# Altium schematic sheet EVK-NORA-W1_SCHEM_0003_Shield_Conn.SchDoc
size B; Date: 7/24/2020; CompanyName: U-blox; DrawnBy: EMOO; Engineer: EMOO; Organization: U-blox; Address1: 3950 Fairview Industrial Dr SE #100; Address2: Salem, OR 97302; SheetNumber: 5; SheetTotal: 6; SheetSize: B; SheetTitle: Connectors
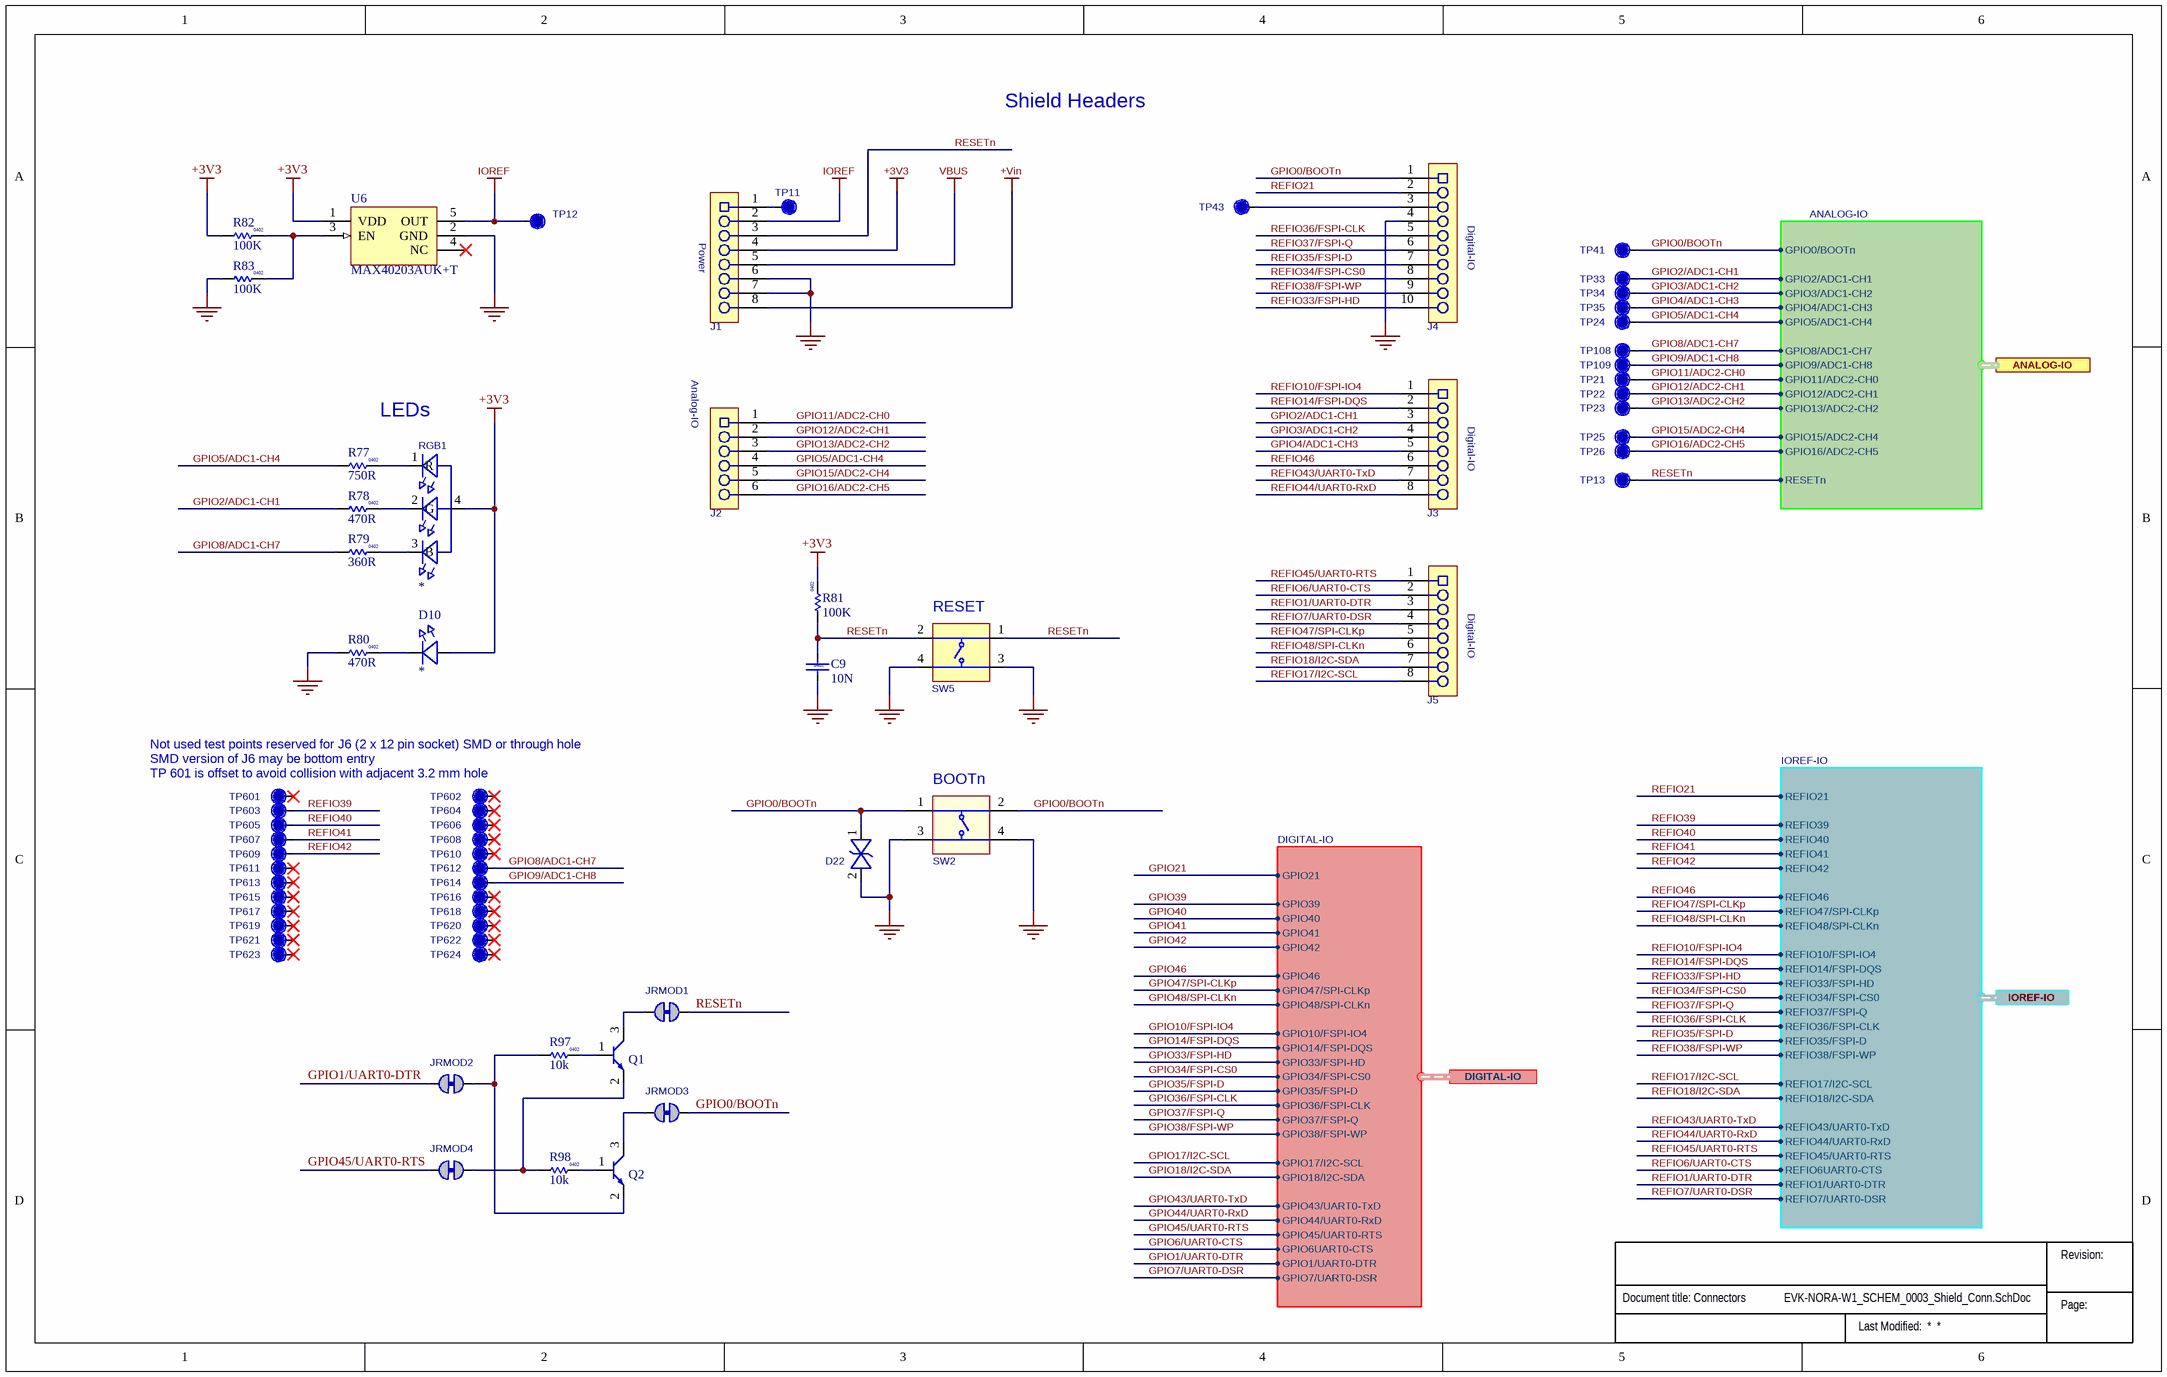
[diagram p0: EVK-NORA-W1_SCHEM_0003_Shield_Conn.SchDoc]

## Parts
?  (no value)  (graphical)
C9  value 10N  Size: 0402  [Cap 0402]
D10  (no value)  [LED-0603]
D22  110-00019  [SOD-923]  (value not drawn)
J1  (no value)  [SKT-0.1P-SSM-108-L-SV]
J2  (no value)  [SKT-0.1P-SSM-106-L-SV]
J3  (no value)  [SKT-0.1P-SSM-108-L-SV]
J4  (no value)  [SKT-0.1P-SSM-110-L-SV]
J5  (no value)  [SKT-0.1P-SSM-108-L-SV]
JRMOD1  Solderbridge-ShortDNP  [Solderbridge-Short]  (value not drawn)  (net tie, no BOM)
JRMOD2  Solderbridge-ShortDNP  [Solderbridge-Short]  (value not drawn)  (net tie, no BOM)
JRMOD3  Solderbridge-ShortDNP  [Solderbridge-Short]  (value not drawn)  (net tie, no BOM)
JRMOD4  Solderbridge-ShortDNP  [Solderbridge-Short]  (value not drawn)  (net tie, no BOM)
Q1  (no value)  [SOT-23]
Q2  (no value)  [SOT-23]
R77  value 750R  Size: 0402  [RES 0402 HD]
R78  value 470R  Size: 0402  [RES 0402 HD]
R79  value 360R  Size: 0402  [RES 0402 HD]
R80  value 470R  Size: 0402  [RES 0402 HD]
R81  value 100K  Size: 0402  [RES 0402 HD]
R82  value 100K  Size: 0402  [RES 0402 HD]
R83  value 100K  Size: 0402  [RES 0402 HD]
R97  value 10k  Size: 0402  [RES 0402 HD]
R98  value 10k  Size: 0402  [RES 0402 HD]
RGB1  (no value)  [LED_1616]
SW2  (no value)  [SW_TACT_SMT_6mm]
SW5  135-00002  [SW_TACT_SMT_6mm]  (value not drawn)
TP11  TP  [TP10R]  (value not drawn)  (no BOM)
TP12  TP  [TP10R]  (value not drawn)  (no BOM)
TP13  TP  [TP10R]  (value not drawn)  (no BOM)
TP21  TP  [TP10R]  (value not drawn)  (no BOM)
TP22  TP  [TP10R]  (value not drawn)  (no BOM)
TP23  TP  [TP10R]  (value not drawn)  (no BOM)
TP24  TP  [TP10R]  (value not drawn)  (no BOM)
TP25  TP  [TP10R]  (value not drawn)  (no BOM)
TP26  TP  [TP10R]  (value not drawn)  (no BOM)
TP33  TP  [TP10R]  (value not drawn)  (no BOM)
TP34  TP  [TP10R]  (value not drawn)  (no BOM)
TP35  TP  [TP10R]  (value not drawn)  (no BOM)
TP41  TP  [TP10R]  (value not drawn)  (no BOM)
TP43  TP  [TP10R]  (value not drawn)  (no BOM)
TP108  TP  [TP10R]  (value not drawn)  (no BOM)
TP109  TP  [TP10R]  (value not drawn)  (no BOM)
TP601  TP  [TP10R]  (value not drawn)  (no BOM)
TP602  TP  [TP10R]  (value not drawn)  (no BOM)
TP603  TP  [TP10R]  (value not drawn)  (no BOM)
TP604  TP  [TP10R]  (value not drawn)  (no BOM)
TP605  TP  [TP10R]  (value not drawn)  (no BOM)
TP606  TP  [TP10R]  (value not drawn)  (no BOM)
TP607  TP  [TP10R]  (value not drawn)  (no BOM)
TP608  TP  [TP10R]  (value not drawn)  (no BOM)
TP609  TP  [TP10R]  (value not drawn)  (no BOM)
TP610  TP  [TP10R]  (value not drawn)  (no BOM)
TP611  TP  [TP10R]  (value not drawn)  (no BOM)
TP612  TP  [TP10R]  (value not drawn)  (no BOM)
TP613  TP  [TP10R]  (value not drawn)  (no BOM)
TP614  TP  [TP10R]  (value not drawn)  (no BOM)
TP615  TP  [TP10R]  (value not drawn)  (no BOM)
TP616  TP  [TP10R]  (value not drawn)  (no BOM)
TP617  TP  [TP10R]  (value not drawn)  (no BOM)
TP618  TP  [TP10R]  (value not drawn)  (no BOM)
TP619  TP  [TP10R]  (value not drawn)  (no BOM)
TP620  TP  [TP10R]  (value not drawn)  (no BOM)
TP621  TP  [TP10R]  (value not drawn)  (no BOM)
TP622  TP  [TP10R]  (value not drawn)  (no BOM)
TP623  TP  [TP10R]  (value not drawn)  (no BOM)
TP624  TP  [TP10R]  (value not drawn)  (no BOM)
U6  Manufacturer Part Number 1: MAX40203AUK+T  [SOT-23-5]

## Ports
ANALOG-IO (harness ANALOG-IO), DIGITAL-IO (harness DIGITAL-IO), IOREF-IO (harness IOREF-IO)

## Harnesses
ANALOG-IO: GPIO0/BOOTn, GPIO11/ADC2-CH0, GPIO12/ADC2-CH1, GPIO13/ADC2-CH2, GPIO15/ADC2-CH4, GPIO16/ADC2-CH5, GPIO2/ADC1-CH1, GPIO3/ADC1-CH2, GPIO4/ADC1-CH3, GPIO5/ADC1-CH4, GPIO8/ADC1-CH7, GPIO9/ADC1-CH8, RESETn
IOREF-IO: REFIO1/UART0-DTR, REFIO10/FSPI-IO4, REFIO14/FSPI-DQS, REFIO17/I2C-SCL, REFIO18/I2C-SDA, REFIO21, REFIO33/FSPI-HD, REFIO34/FSPI-CS0, REFIO37/FSPI-Q, REFIO36/FSPI-CLK, REFIO35/FSPI-D, REFIO38/FSPI-WP, REFIO39, REFIO40, REFIO41, REFIO42, REFIO43/UART0-TxD, REFIO44/UART0-RxD, REFIO45/UART0-RTS, REFIO46, REFIO47/SPI-CLKp, REFIO48/SPI-CLKn, REFIO6UART0-CTS, REFIO7/UART0-DSR
DIGITAL-IO: GPIO1/UART0-DTR, GPIO6UART0-CTS, GPIO7/UART0-DSR, GPIO10/FSPI-IO4, GPIO14/FSPI-DQS, GPIO17/I2C-SCL, GPIO18/I2C-SDA, GPIO21, GPIO33/FSPI-HD, GPIO34/FSPI-CS0, GPIO35/FSPI-D, GPIO36/FSPI-CLK, GPIO37/FSPI-Q, GPIO38/FSPI-WP, GPIO39, GPIO40, GPIO41, GPIO42, GPIO43/UART0-TxD, GPIO44/UART0-RxD, GPIO45/UART0-RTS, GPIO46, GPIO47/SPI-CLKp, GPIO48/SPI-CLKn

## Nets
+3V3: D10.2(A) J1.4 R81.2 R82.1 RGB1.4(A) U6.1(VDD)
+Vin: J1.8
GND: C9.2 D22.2 J1.6 J1.7 J4.4 R80.1 R83.1 SW2.3 SW2.4 SW5.3(T3) SW5.4(T3) U6.2(GND)
IOREF: J1.2 TP12.1 U6.5(OUT)
VBUS: J1.5
GPIO0/BOOTn: D22.1 J4.1 JRMOD3.1 SW2.1 SW2.2 TP41.1 ; port ANALOG-IO.GPIO0/BOOTn
GPIO1/UART0-DTR: JRMOD2.2 ; port DIGITAL-IO.GPIO1/UART0-DTR
GPIO2/ADC1-CH1: J3.3 R78.1 TP33.1 ; port ANALOG-IO.GPIO2/ADC1-CH1
GPIO3/ADC1-CH2: J3.4 TP34.1 ; port ANALOG-IO.GPIO3/ADC1-CH2
GPIO4/ADC1-CH3: J3.5 TP35.1 ; port ANALOG-IO.GPIO4/ADC1-CH3
GPIO5/ADC1-CH4: J2.4 R77.1 TP24.1 ; port ANALOG-IO.GPIO5/ADC1-CH4
GPIO6/UART0-CTS: port DIGITAL-IO.GPIO6UART0-CTS
GPIO7/UART0-DSR: port DIGITAL-IO.GPIO7/UART0-DSR
GPIO8/ADC1-CH7: R79.1 TP108.1 TP612.1 ; port ANALOG-IO.GPIO8/ADC1-CH7
GPIO9/ADC1-CH8: TP109.1 TP614.1 ; port ANALOG-IO.GPIO9/ADC1-CH8
GPIO10/FSPI-IO4: port DIGITAL-IO.GPIO10/FSPI-IO4
GPIO11/ADC2-CH0: J2.1 TP21.1 ; port ANALOG-IO.GPIO11/ADC2-CH0
GPIO12/ADC2-CH1: J2.2 TP22.1 ; port ANALOG-IO.GPIO12/ADC2-CH1
GPIO13/ADC2-CH2: J2.3 TP23.1 ; port ANALOG-IO.GPIO13/ADC2-CH2
GPIO14/FSPI-DQS: port DIGITAL-IO.GPIO14/FSPI-DQS
GPIO15/ADC2-CH4: J2.5 TP25.1 ; port ANALOG-IO.GPIO15/ADC2-CH4
GPIO16/ADC2-CH5: J2.6 TP26.1 ; port ANALOG-IO.GPIO16/ADC2-CH5
GPIO17/I2C-SCL: port DIGITAL-IO.GPIO17/I2C-SCL
GPIO18/I2C-SDA: port DIGITAL-IO.GPIO18/I2C-SDA
GPIO21: port DIGITAL-IO.GPIO21
GPIO33/FSPI-HD: port DIGITAL-IO.GPIO33/FSPI-HD
GPIO34/FSPI-CS0: port DIGITAL-IO.GPIO34/FSPI-CS0
GPIO35/FSPI-D: port DIGITAL-IO.GPIO35/FSPI-D
GPIO36/FSPI-CLK: port DIGITAL-IO.GPIO36/FSPI-CLK
GPIO37/FSPI-Q: port DIGITAL-IO.GPIO37/FSPI-Q
GPIO38/FSPI-WP: port DIGITAL-IO.GPIO38/FSPI-WP
GPIO39: port DIGITAL-IO.GPIO39
GPIO40: port DIGITAL-IO.GPIO40
GPIO41: port DIGITAL-IO.GPIO41
GPIO42: port DIGITAL-IO.GPIO42
GPIO43/UART0-TxD: port DIGITAL-IO.GPIO43/UART0-TxD
GPIO44/UART0-RxD: port DIGITAL-IO.GPIO44/UART0-RxD
GPIO45/UART0-RTS: JRMOD4.2 ; port DIGITAL-IO.GPIO45/UART0-RTS
GPIO46: port DIGITAL-IO.GPIO46
GPIO47/SPI-CLKp: port DIGITAL-IO.GPIO47/SPI-CLKp
GPIO48/SPI-CLKn: port DIGITAL-IO.GPIO48/SPI-CLKn
REFIO1/UART0-DTR: J5.3 ; port IOREF-IO.REFIO1/UART0-DTR
REFIO6/UART0-CTS: J5.2 ; port IOREF-IO.REFIO6UART0-CTS
REFIO7/UART0-DSR: J5.4 ; port IOREF-IO.REFIO7/UART0-DSR
REFIO10/FSPI-IO4: J3.1 ; port IOREF-IO.REFIO10/FSPI-IO4
REFIO14/FSPI-DQS: J3.2 ; port IOREF-IO.REFIO14/FSPI-DQS
REFIO17/I2C-SCL: J5.8 ; port IOREF-IO.REFIO17/I2C-SCL
REFIO18/I2C-SDA: J5.7 ; port IOREF-IO.REFIO18/I2C-SDA
REFIO21: J4.2 ; port IOREF-IO.REFIO21
REFIO33/FSPI-HD: J4.10 ; port IOREF-IO.REFIO33/FSPI-HD
REFIO34/FSPI-CS0: J4.8 ; port IOREF-IO.REFIO34/FSPI-CS0
REFIO35/FSPI-D: J4.7 ; port IOREF-IO.REFIO35/FSPI-D
REFIO36/FSPI-CLK: J4.5 ; port IOREF-IO.REFIO36/FSPI-CLK
REFIO37/FSPI-Q: J4.6 ; port IOREF-IO.REFIO37/FSPI-Q
REFIO38/FSPI-WP: J4.9 ; port IOREF-IO.REFIO38/FSPI-WP
REFIO39: TP603.1 ; port IOREF-IO.REFIO39
REFIO40: TP605.1 ; port IOREF-IO.REFIO40
REFIO41: TP607.1 ; port IOREF-IO.REFIO41
REFIO42: TP609.1 ; port IOREF-IO.REFIO42
REFIO43/UART0-TxD: J3.7 ; port IOREF-IO.REFIO43/UART0-TxD
REFIO44/UART0-RxD: J3.8 ; port IOREF-IO.REFIO44/UART0-RxD
REFIO45/UART0-RTS: J5.1 ; port IOREF-IO.REFIO45/UART0-RTS
REFIO46: J3.6 ; port IOREF-IO.REFIO46
REFIO47/SPI-CLKp: J5.5 ; port IOREF-IO.REFIO47/SPI-CLKp
REFIO48/SPI-CLKn: J5.6 ; port IOREF-IO.REFIO48/SPI-CLKn
RESETn: C9.1 J1.3 JRMOD1.1 R81.1 SW5.1(T1) SW5.2(T2) TP13.1 ; port ANALOG-IO.RESETn
NetD10_1: D10.1(C) R80.2
NetJ1_1: J1.1 TP11.1
NetJ4_3: J4.3 TP43.1
NetJRMOD1_2: JRMOD1.2 Q1.3(C)
NetJRMOD2_1: JRMOD2.1 Q2.2(E) R97.1
NetJRMOD3_2: JRMOD3.2 Q2.3(C)
NetJRMOD4_1: JRMOD4.1 Q1.2(E) R98.1
NetQ1_1: Q1.1(B) R97.2
NetQ2_1: Q2.1(B) R98.2
NetR77_2: R77.2 RGB1.1(R)
NetR78_2: R78.2 RGB1.2(G)
NetR79_2: R79.2 RGB1.3(B)
NetR82_2: R82.2 R83.2 U6.3(EN)

Not connected (* = marked no-connect by the designer): TP601 1*; TP602 1*; TP604 1*; TP606 1*; TP608 1*; TP610 1*; TP611 1*; TP613 1*; TP615 1*; TP616 1*; TP617 1*; TP618 1*; TP619 1*; TP620 1*; TP621 1*; TP622 1*; TP623 1*; TP624 1*; U6 4(NC)*

## Notes on the sheet
- Shield Headers
- (near J1) Power
- (near J4) Digital-IO
- LEDs
- (near J2) Analog-IO
- (near J3) Digital-IO
- (near SW5) RESET
- (near J5) Digital-IO
- Not used test points reserved for J6 (2 x 12 pin socket) SMD or through hole
- SMD version of J6 may be bottom entry
- TP 601 is offset to avoid collision with adjacent 3.2 mm hole
- (near SW2) BOOTn
- Revision:
- Page:

## Library data of the parts
? = Sub_Title_Block: Minimized schematic title block for all subset sheets
C9 = UBXH01-0023025: CAP CER X7R 0402 10N 10% 16V; Manufacturer: Murata Manufacturing Company, Ltd.; Manufacturer P/N: GRM155R71C103KA01; Editor: roland.rust; Released by: anthony.gergis; Env: ROHS; Permitted Use: Volume Products; Perferred: PREF; Mfg P/N Status: NRND; Mfg P/N Split: 100; Mfg P/N Released: Yes; Part Number: UBXH01-0023025; Tolerance: 10%; Max Voltage: 16V; Min Operating Temp: -55°C; Max Operating Temp: 125°C; Part Type: Capacitor; Release Data: 2021-02-16 13:14:11.218378; UBX Wiki: https://wiki.u-blox.com/bin/view/Operations/PartDetails?index=5491; RefDes: C; Manufacturer 2: Samsung Electro-Mechanics; Manufacturer P/N 2: CL05B103KO5NNNC; Mfg P/N Status 2: Active; Mfg P/N Split 2: 0; Mfg P/N Released 2: Yes; Mfg P/N Datasheet 2: https://wiki.u-blox.com/bin/view/Generic/Docs/DocumentSummary?index=28567
D10 = UBXH11-0000018: LED CHIP 0603 LOW CURRENT OSRAM 0.002A GREEN 2.2V 2mA; Manufacturer P/N: LG L29K-G2J1-24; Editor: johann.furrer; Released by: martin.grasse; Env: ROHS; Permitted Use: Volume Products; Perferred: PREF; Mfg P/N Status: Active; Mfg P/N Split: 100; Mfg P/N Released: Yes; Color: *; Part Number: UBXH11-0000018; Value: GREEN; Max Voltage: 2.2V; Max Current: 2mA; Size: 0603; Min Operating Temp: -40°C; Max Operating Temp: 85°C; Part Type: LED; Release Data: 2018-01-09 15:31:38.754561; UBX Wiki: https://wiki.u-blox.com/bin/view/Operations/PartDetails?index=20619; RefDes: DS; Manufacturer: Osram; Mfg P/N Datasheet: https://wiki.u-blox.com/bin/view/Generic/Docs/DocumentSummary?index=20620
D22 = 110-00019: ESD9B3.3ST5G; Part Name: Diode TVS 3.3V SOD-923; Part_Type: Diode; Manufacturer: ON Semiconductor; Item_Phase: Preliminary; Body Size: 0.8mm x 0.6mm; Component Mounting Type: SMT; Diode Type: TVS; Use in new designs: Yes; Voltage: 3.3V; Part Number: 110-00019; Manufacturer P/N: ESD9B3.3ST5G; Supplier 1: Digi-Key; Supplier Part Number 1: ESD9B3.3ST5GOSCT-ND; Arena Link: https://app.bom.com/a/4M5DJQ9Q9SR7DV4H?v=spec.summary; Height: 0.4mm; MFG Package: SOD-923; Package Type: SOD; Pins: 2
J1 J3 J5 = 130-00102: Socket Strip 0.1" 8 Pin 1Row SMD Black; Manufacturer 1: Seeed Technology; Manufacturer Part Number 1: Rigado 130-00102; Part Name: CON SKT Strip 0.1" 8Pin 1Row SMD Black; Item Phase: In Production; Use in new designs: Yes; Voltage: 572VDC; UBX Code: None; Part Number: 130-00102; Supplier 1: Seeed Technology; Supplier Part Number 1: Rigado 130-00102; Diameter: None; Height: 7.37mm; Max Operating Temp: 105; Min Operating Temp: -55; Pins: 8; Revision: 0C; Manufacturer 2: Samtec; Manufacturer Part Number 2: SSM-108-F-SV-P-TR; Supplier 2: Avnet; Supplier Part Number 2: SSM-108-F-SV-P-TR
J2 = 130-00103: Socket Strip 0.1" 6Pin 1Row SMD Black; Manufacturer 1: Seeed Technology; Manufacturer Part Number 1: Rigado 130-00103; Part Name: CON SKT Strip 0.1" 6Pin 1Row SMD Black; Item Phase: In Production; Use in new designs: Yes; Voltage: 572VDC; UBX Code: None; Manufacturer P/N: *; Part Number: 130-00103; Supplier 1: Seeed Technology; Supplier Part Number 1: Rigado 130-00103; Diameter: None; Height: 7.37mm; Max Operating Temp: 105; Min Operating Temp: -55; Pins: 6; Revision: 0C; Manufacturer 2: Samtec; Manufacturer Part Number 2: SSM-106-F-SV-P-TR; Supplier 2: Avnet; Supplier Part Number 2: SSM-106-F-SV-P-TR
J4 = 130-00101: Socket Strip 0.1" 10Pin 1Row SMD Black; Manufacturer 1: Seeed Technology; Manufacturer Part Number 1: Rigado 130-00101; Part Name: CON SKT Strip 0.1" 10Pin 1Row SMD Black; Item Phase: In Production; Use in new designs: Yes; Voltage: 572VDC; UBX Code: None; Part Number: 130-00101; Supplier 1: Seeed Technology; Supplier Part Number 1: Rigado 130-00101; Diameter: None; Height: 7.37mm; Max Operating Temp: 105; Min Operating Temp: -55; Pins: 10; Revision: 0C; Manufacturer 2: Samtec; Manufacturer Part Number 2: SSM-110-F-SV-P-TR; Supplier 2: Avnet; Supplier Part Number 2: SSM-110-F-SV-P-TR
JRMOD1-JRMOD4 = Solderbridge-Short: Added By: Paul B; Part Number: Solderbridge-Short; Height: 0; DNP: DNP; Added Date: 12/2/2015
Q1 Q2 = UBXH20-0000052: GENERAL PURPOSE SINGLE NPN TRANSISTOR SOT-23 45V 800mA; Manufacturer: ON Semiconductor; Value: BCW66GLT3G; Editor: jaakko.jussila; Released by: alex.claville; Env: ROHS; Permitted Use: Support Products; Perferred: PREF; Mfg P/N Status: Active; Mfg P/N Split: 100; Mfg P/N Released: Yes; Part Number: UBXH20-0000052; Max Voltage: 45V; Max Current: 800mA; Min Operating Temp: -55°C; Max Operating Temp: 155°C; Part Type: Transistor; Release Data: 2019-05-06T10:58:51; UBX Wiki: https://wiki.u-blox.com/bin/view/Operations/PartDetails?index=26834; RefDes: Q; Manufacturer P/N: BCW66GLT3G; Mfg P/N Datasheet: https://wiki.u-blox.com/bin/view/Generic/Docs/DocumentSummary?index=26837
R77 = UBXH18-0008046: RES THICK FILM CHIP 0402 750R 5% 100mW; Manufacturer: Panasonic; Manufacturer P/N: ERJ2GEJ751X; Editor: jaka.bevk; Released by: erian.bezhani; Env: ROHS; Permitted Use: Volume Products; Perferred: PREF; Mfg P/N Status: Active; Mfg P/N Split: 100; Mfg P/N Released: Yes; Part Number: UBXH18-0008046; Tolerance: 5%; Max Power: 100mW; Part Type: Resistor; Release Data: 2014-10-03 09:31:33.687559; UBX Wiki: https://wiki.u-blox.com/bin/view/Operations/PartDetails?index=6935; RefDes: R; Mfg P/N Datasheet: https://wiki.u-blox.com/bin/view/Generic/Docs/DocumentSummary?index=21267
R78 R80 = UBXH18-0008041: RES THICK FILM CHIP 0402 470R 5% 100mW; Manufacturer: ROHM; Manufacturer P/N: MCR01MZPJ471; Editor: roland.rust; Env: ROHS; Permitted Use: Volume Products; Perferred: PREF; Mfg P/N Status: Active; Mfg P/N Split: 100; Mfg P/N Released: Yes; Part Number: UBXH18-0008041; Tolerance: 5%; Max Power: 100mW; Part Type: Resistor; Released by: roland.rust; Release Data: 2009-04-24 14:36:39; UBX Wiki: https://wiki.u-blox.com/bin/view/Operations/PartDetails?index=6926; RefDes: R; Manufacturer 2: KOA; Manufacturer P/N 2: RK73B1ETTP471J; Mfg P/N Status 2: Active; Mfg P/N Split 2: 0; Mfg P/N Released 2: Yes; Manufacturer 3: YAGEO; Manufacturer P/N 3: 2322_705_87471_L; Mfg P/N Status 3: NRND; Mfg P/N Split 3: 0; Mfg P/N Released 3: Yes
R79 = UBXH18-0000216: RES THICK FILM CHIP 0402 360R 1% 63mW; Manufacturer: KOA; Manufacturer P/N: RK73H1ETTP3600F; Editor: michael.hein; Released by: vasyl.dykyy; Env: ROHS; Permitted Use: Volume Products; Perferred: PREF; Mfg P/N Status: Active; Mfg P/N Split: 100; Mfg P/N Released: Yes; Part Number: UBXH18-0000216; Tolerance: 1%; Max Power: 63mW; Part Type: Resistor; Release Data: 2015-10-02 11:55:45.476057; Automotive: Yes; UBX Wiki: https://wiki.u-blox.com/bin/view/Operations/PartDetails?index=23306; RefDes: R; Mfg P/N Datasheet: https://wiki.u-blox.com/bin/view/Generic/Docs/DocumentSummary?index=8222
R81-R83 = UBXH18-0008097: RES THICK FILM CHIP 0402 100K 5% 100mW; Manufacturer: YAGEO; Manufacturer P/N: 2322_705_70104_L; Editor: roland.rust; Env: ROHS; Permitted Use: Volume Products; Perferred: PREF; Mfg P/N Status: NRND; Mfg P/N Split: 100; Mfg P/N Released: Yes; Part Number: UBXH18-0008097; Tolerance: 5%; Max Power: 100mW; Part Type: Resistor; Released by: roland.rust; Release Data: 2005-07-22 13:59:44; UBX Wiki: https://wiki.u-blox.com/bin/view/Operations/PartDetails?index=7020; RefDes: R; Manufacturer 2: KOA; Manufacturer P/N 2: RK73B1ETTD104J; Mfg P/N Status 2: NRND; Mfg P/N Split 2: 0; Mfg P/N Released 2: Yes
R97 R98 = 180-00024: Resistor 10k ohm 1% 1/16W, 0402; Manufacturer 1: Samsung Electro-Mechanics America, Inc; Manufacturer Part Number 1: RC1005F103CS; Part Name: RES SMD 10K OHM 1% 1/16W 0402; Item Phase: In Production; Tolerance: +/- 1%; Use in new designs: Yes; UBX Code: None; Part Number: 180-00024; Supplier 1: Digi-Key; Supplier Part Number 1: 1276-3431-1-ND; Manufacturer 2: Hong Kong Resistors Manufactory; Manufacturer Part Number 2: RCT0210KFLF; Supplier 2: None; Supplier Part Number 2: None; Height: 0.4mm; Max Operating Temp: 155; Min Operating Temp: -55; Pins: 2; Power: 1/16W; Revision: 0E; Voltage: N/A
RGB1 = 115-00026: LED RGB SMT 0606; Manufacturer 1: Lite-On Inc; Manufacturer Part Number 1: LTST-C19HE1WT; Body Size: 1.6mm x 1.6mm; Current: 20mA; Item Phase: In Production; MFG Package: 0606; Use in new designs: Yes; Voltage: None; Color: *; Part Number: 115-00026; Supplier 1: Digi-Key; Supplier Part Number 1: 160-2162-1-ND; Height: 0.35mm; Max Operating Temp: 80; Min Operating Temp: -20; Part Name: LED RGB SMT 0606; Pins: 4; Revision: 0B; Size: Other; UBX Code: None; Supplier 2: Digi-Key; Supplier Part Number 2: 1516-1184-1-ND
SW2 = 135-00002: Tactile Switch, SPST-NO, SMT, Actuation force = 160g, 6mm x 6mm; Part Name: Button Tactile SPST-NO 50mA 6mm SMT; Part_Type: Button; Manufacturer: C&K Components; Manufacturer P/N: PTS645SM43SMTR92 LFS; Item_Phase: Production; Current: 50mA; Switch/Button Circuit: SPST; Switch/Button Function: Off-Mom; Use in new designs: Yes; Voltage: 12VDC; Part Number: 135-00002; Supplier 1: Digi-Key; Supplier Part Number 1: CKN9112CT-ND; Arena Link: https://app.bom.com/a/L3MU07Q7Q98QQQW6?v=spec.summary; Body Size: 6mm x 6mm; Component Mounting Type: SMT; Height: 4.4mm; Pins: 4; Revision: 0B; Manufacturer 2: Seeed Technology; Manufacturer P/N 2: Rigado 135-00002; Supplier 2: Seeed Technology; Supplier Part Number 2: Rigado 135-00002
SW5 = 135-00002: Tactile Switch, SPST-NO, SMT 160gf.; Part Name: Button Tactile SPST-NO 50mA 6mm SMT; Part_Type: Button; Manufacturer: C&K Components; Manufacturer P/N: PTS645SM43SMTR92 LFS; Item_Phase: Preliminary; Body Size: 6mm x 6mm; Current: 50mA; Switch/Button Circuit: SPST; Switch/Button Function: Off-Mom; Use in new designs: Yes; Voltage: 12VDC; Part Number: 135-00002; Supplier 1: Digi-Key; Supplier Part Number 1: CKN9112CT-ND; Arena Link: https://app.bom.com/a/L3MU07Q7Q98QQQW6?v=spec.summary; Component Mounting Type: SMT; Height: 4.3mm; Pins: 4
TP11-TP13 TP21-TP26 TP33-TP35 TP41 TP43 TP108 TP109 TP601-TP624 = TP10R: Testpoint, Round 1.0mm Dia; Added By: Jeremy D; Part Number: TP10R; Size: 1.0mm; Height: 0; DNP: DNP; Added Date: 2/1/2015; Checked By: Paul B; Checked Date: 2/5/2015
U6 = 265-00058: Ideal Diode - OR Controller Source Selector Switch P-Channel 1:1 SOT-23-5; Manufacturer 1: Maxim Integrated Products; Item_Phase: Preliminary; Body Size: None; Component Mounting Type: SMT; Current: 1A; SMT Pitch: 0.95mm; Use in new designs: Yes; Voltage: 5.5V; Interface: Discrete; Item Phase: Unreleased; Reg Outputs: 1xLoad Switch; Part Number: 265-00058; Part Name: MAX40203AUK; Part_Type: Ideal Diode; Supplier 1: Digi-Key; Supplier Part Number 1: 175-MAX40203AUK+TTR-ND; Height: None; MFG Package: SOT-23-5; Package Type: SOT-23-5; Pins: 5; HelpURL: https://datasheets.maximintegrated.com/en/ds/MAX40203.pdf; Application: Power Switch; Max Operating Temp: 85; Min Operating Temp: -40; Revision: None; Thermal Pad: None; UBX Code: None; Manufacturer 2: None; Manufacturer Part Number 2: None; Supplier 2: None; Supplier Part Number 2: None